# EAGLE design WiFi_Switch (EAGLE 7.7.0)
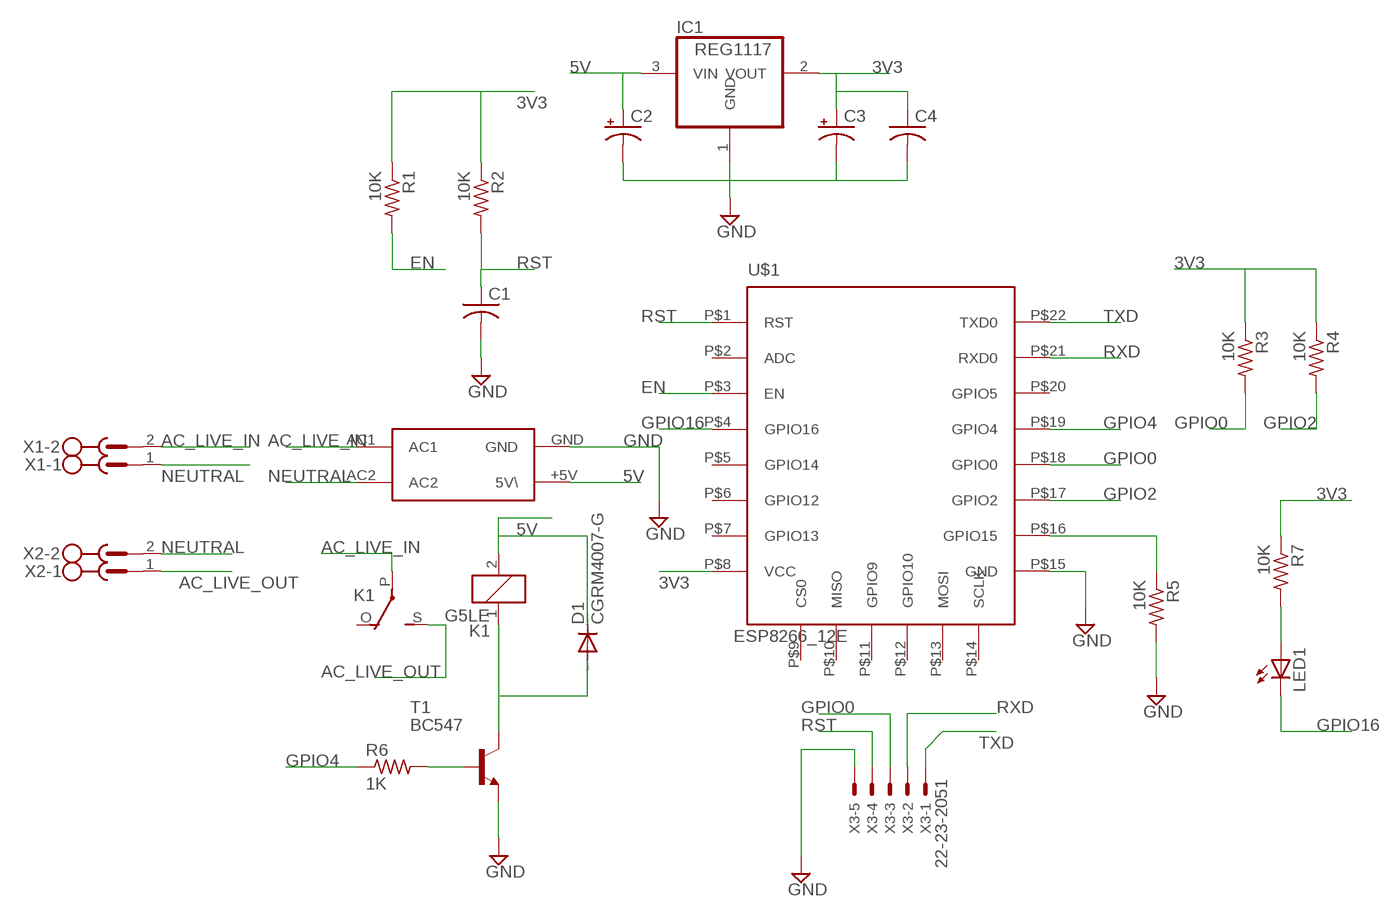
[diagram p0: schematic, sheet 1]

## Parts
C1  C-USC1206  [C1206]
C2  CPOL-USE5-6  [E5-6]
C3  CPOL-USE5-6  [E5-6]
C4  C-USC1206  [C1206]
D1  CGRM4007-G  [SOD-123_MINI-SMA]
IC1  REG1117  [SOT223]
K1  G5LE  [G5LE]
LED1  LED3MM  [LED3MM]
R1  10K  R-US_R1206  [R1206]
R2  10K  R-US_R1206  [R1206]
R3  10K  R-US_R1206  [R1206]
R4  10K  R-US_R1206  [R1206]
R5  10K  R-US_R1206  [R1206]
R6  1K  R-US_R1206  [R1206]
R7  10K  R-US_R1206  [R1206]
T1  BC547  [TO92]
U$1  ESP8266_12E  [SMT_ESP8266]
U$2  HILINK_SMPS_5V5W  [PCB_MOUNT]
X1  MSTBV2  [MSTBV2]
X2  MSTBV2  [MSTBV2]
X3  22-23-2051  [22-23-2051]

## Nets
3V3: C3.+ C4.1 IC1.2(VOUT) R1.1 R2.1 R3.1 R4.1 R7.1 U$1.P$8(VCC)
5V: C2.+ D1.C IC1.3(VIN) K1.2 U$2.+5V(5V\)
AC_LIVE_IN: K1.P(2:P) U$2.AC1 X1.2
AC_LIVE_OUT: K1.S(2:S) X2.1
EN: R1.2 U$1.P$3(EN)
GND: C1.2 C2.- C3.- C4.2 IC1.1(GND) R5.2 T1.1(E) U$1.P$15(GND) U$2.GND X3.5
GPIO0: R3.2 U$1.P$18(GPIO0) X3.3
GPIO2: R4.2 U$1.P$17(GPIO2)
GPIO4: R6.1 U$1.P$19(GPIO4)
GPIO16: LED1.K(C) U$1.P$4(GPIO16)
N$1: R5.1 U$1.P$16(GPIO15)
N$2: R6.2 T1.2(B)
N$3: D1.A K1.1 T1.3(C)
N$37: LED1.A R7.2
NEUTRAL: U$2.AC2 X1.1 X2.2
RST: C1.1 R2.2 U$1.P$1(RST) X3.4
RXD: U$1.P$21(RXD0) X3.2
TXD: U$1.P$22(TXD0) X3.1
Unconnected: K1.O(2:O) U$1.P$2(ADC) U$1.P$5(GPIO14) U$1.P$6(GPIO12) U$1.P$7(GPIO13) U$1.P$9(CS0) U$1.P$10(MISO) U$1.P$11(GPIO9) U$1.P$12(GPIO10) U$1.P$13(MOSI) U$1.P$14(SCLK) U$1.P$20(GPIO5)

## Library data of the parts
C1 C4 = rcl:C-US: CAPACITOR, American symbol
C2 C3 = rcl:CPOL-US: POLARIZED CAPACITOR, American symbol
D1 = diode:CGRM400*-G: Molded plasitc,JEDEC SOD-123/Mini SMA Source: Comchip CGRM4001-G.pdf
IC1 = burr-brown:REG1117: 800mA and 1A Low Dropout (LDO) Positive Regulator 1.8V, 2.5V, 2.85V, 3.3V, 5V, and Adj; MPN: REG1117; OC_FARNELL: 1097566; OC_NEWARK: 14P6981
K1 = relay:G5LE: RELAY 1 x switch, 10 A/120 V AC, 8 A/30 V DC, Omron; OC_FARNELL: unknown; OC_NEWARK: unknown
LED1 = led:LED: LED OSRAM: - CHIPLED LG R971, LG N971, LY N971, LG Q971, LY Q971, LO R971, LY R971 LH N974, LH R974 LS Q976, LO Q976, LY Q976 LO Q996 - Hyper CHIPLED LW Q18S LB Q993, LB Q99A, LB R99A - SideLED LS A670, LO A670, LY A670, LG A670, LP A670 LB A673, LV A673, LT A673, LW A673 LH A674 LY A675 LS A676, LA A676, LO A676, LY A676, LW A676 LS A679, LY A679, LG A679 - Hyper Micro SIDELED® LS Y876, LA Y876, LO Y876, LY Y876 LT Y87S - SmartLED LW L88C, LW L88S LB L89C, LB L89S, LG L890 LS L89K, LO L89K, LY L89K LS L896, LA L896, LO L896, LY L896 - TOPLED LS T670, LO T670, LY T670, LG T670, LP T670 LSG T670, LSP T670, LSY T670, LOP T670, LYG T670 LG T671, LOG T671, LSG T671 LB T673, LV T673, LT T673, LW T673 LH T674 LS T676, LA T676, LO T676, LY T676, LB T676, LH T676, LSB T676, LW T676 LB T67C, LV T67C, LT T67C, LS T67K, LO T67K, LY T67K, LW E67C LS E67B, LA E67B, LO E67B, LY E67B, LB E67C, LV E67C, LT E67C LW T67C LS T679, LY T679, LG T679 LS T770, LO T770, LY T770, LG T770, LP T770 LB T773, LV T773, LT T773, LW T773 LH T774 LS E675, LA E675, LY E675, LS T675 LS T776, LA T776, LO T776, LY T776, LB T776 LHGB T686 LT T68C, LB T68C - Hyper Mini TOPLED® LB M676 - Mini TOPLED Santana® LG M470 LS M47K, LO M47K, LY M47K Source: http://www.osram.convergy.de LUXEON: - LUMILED® LXK2-PW12-R00, LXK2-PW12-S00, LXK2-PW14-U00, LXK2-PW14-V00 LXK2-PM12-R00, LXK2-PM12-S00, LXK2-PM14-U00 LXK2-PE12-Q00, LXK2-PE12-R00, LXK2-PE12-S00, LXK2-PE14-T00, LXK2-PE14-U00 LXK2-PB12-K00, LXK2-PB12-L00, LXK2-PB12-M00, LXK2-PB14-N00, LXK2-PB14-P00, LXK2-PB14-Q00 LXK2-PR12-L00, LXK2-PR12-M00, LXK2-PR14-Q00, LXK2-PR14-R00 LXK2-PD12-Q00, LXK2-PD12-R00, LXK2-PD12-S00 LXK2-PH12-R00, LXK2-PH12-S00 LXK2-PL12-P00, LXK2-PL12-Q00, LXK2-PL12-R00 Source: www.luxeon.com KINGBRIGHT: KA-3528ASYC Source: www.kingbright.com
R1-R7 = resistor:R-US_: RESISTOR, American symbol
T1 = transistor:BC547: NPN TRANSISTOR
U$1 = ESP_WiFi_Module:ESP8266_12E
U$2 = hilink_smps_5w5v:HILINK_SMPS_5V5W
X1 X2 = con-phoenix-500:MSTBV2: PHOENIX; OC_FARNELL: unknown; OC_NEWARK: unknown
X3 = con-molex:22-23-2051: .100" (2.54mm) Center Header - 5 Pin; MF: MOLEX; MPN: 22-23-2051; OC_FARNELL: 1462952; OC_NEWARK: 38C9178

## Board
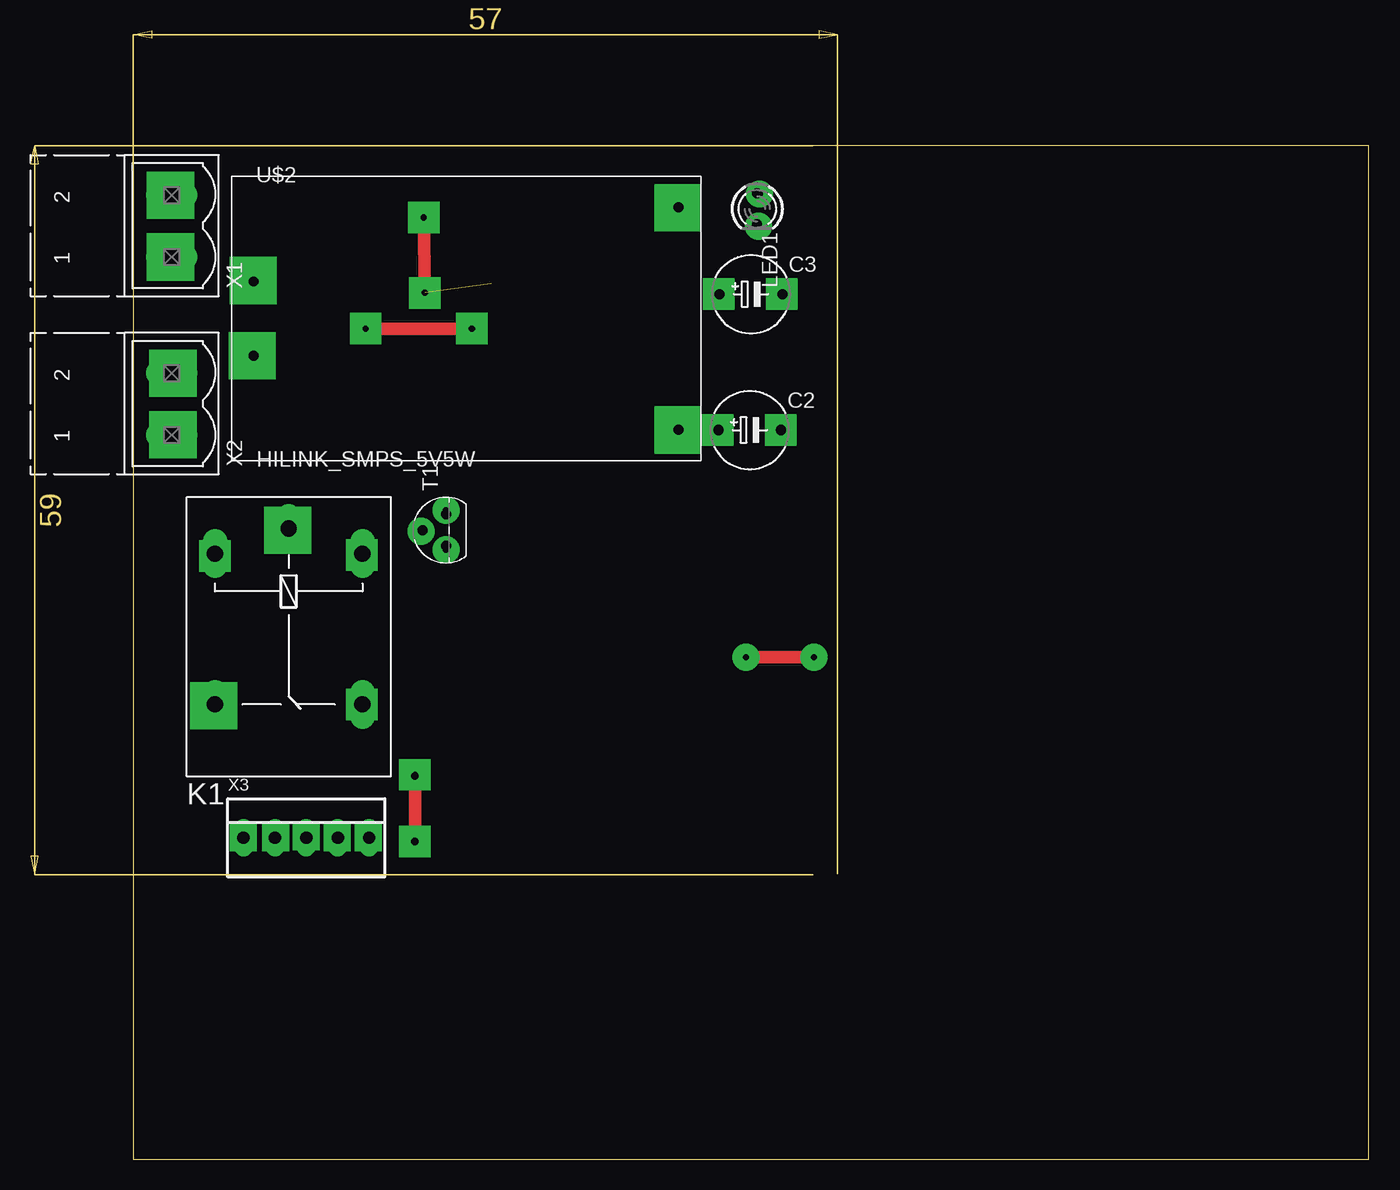
[diagram p1: board, top side]
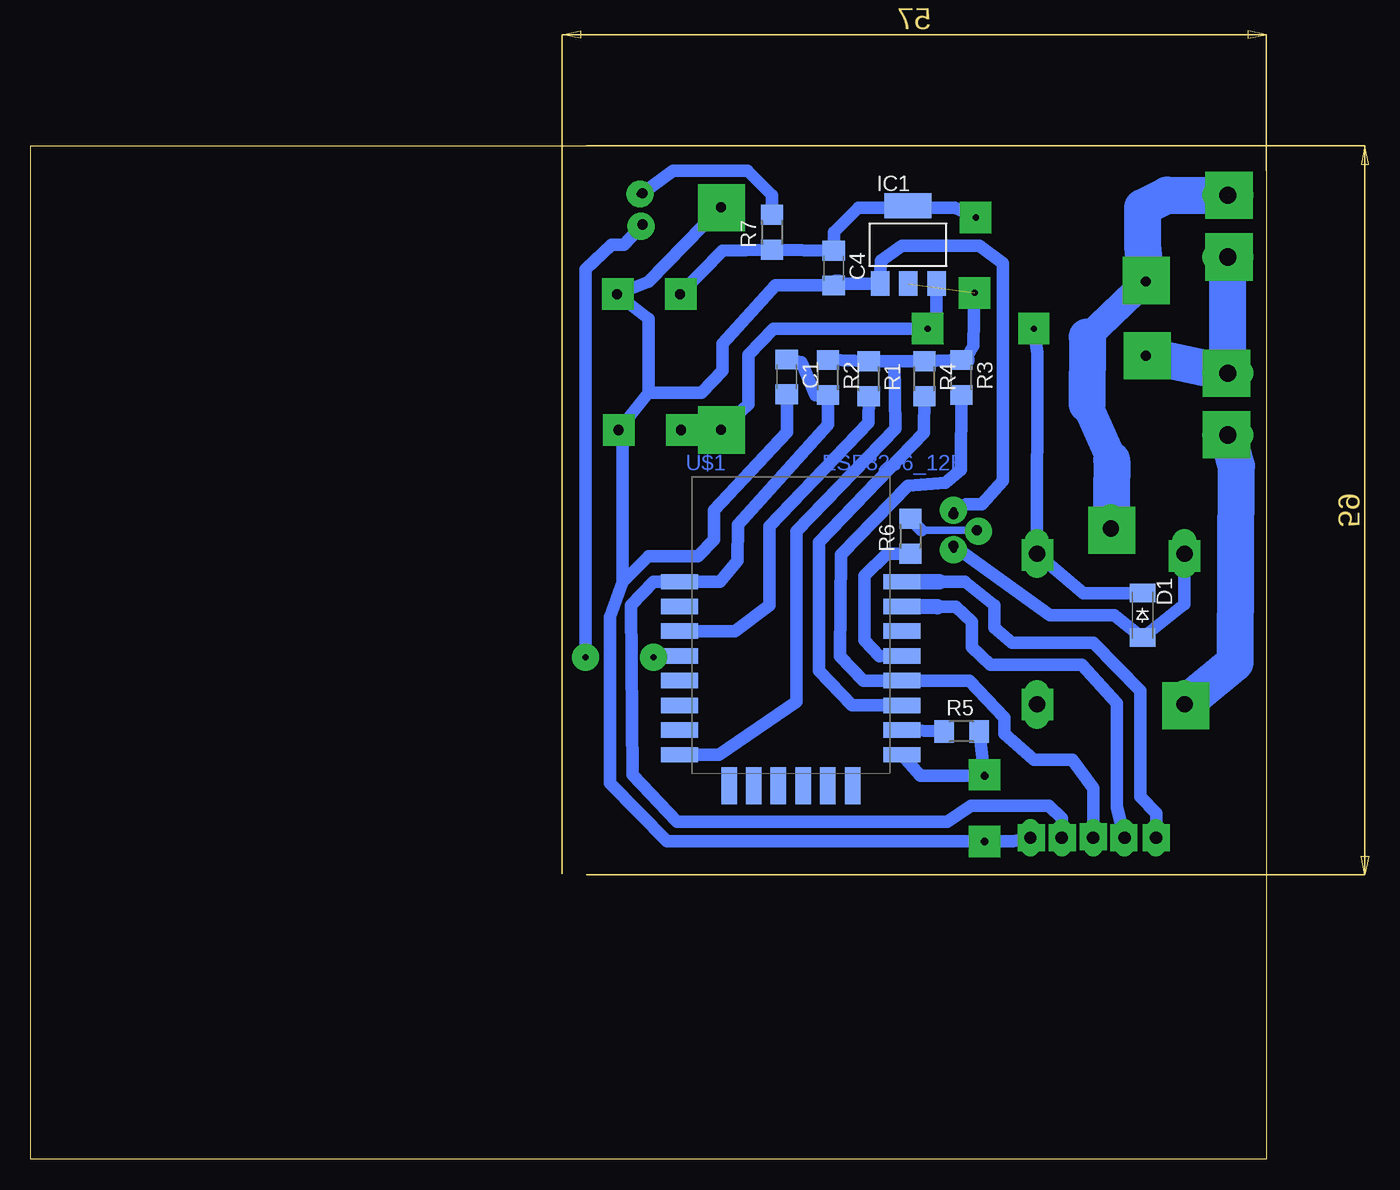
[diagram p2: board, bottom side, seen from below]

Size 100 x 82 mm. Coordinates in mm from the lower left corner, seen from the top.
Outline: 0,0 100,0 100,82 0,82 0,0
Copper layers (1*16): Top 0.035mm / dielectric 1.5mm / Bottom 0.035mm
Design rules "default": minimum track width 10mil, minimum drill 24mil, track to track 8mil, track to pad 8mil, pad to pad 8mil, via to via 8mil, smd to smd 8mil, copper to edge 40mil, drill to drill 8mil, minimum pad ring 10mil, minimum via ring 8mil, stop-mask expansion 4mil, vias tented up to drill 0mil, thermal gap 10mil

### Footprints (pad centres in the part's own frame; a part is rotated, then mirrored left to right if it is on the bottom)
C1206 = smd 1.6 x 1.8: 1 -1.4,0; 2 1.4,0
E5-6 = drill 0.813 pad 1.905: + -2.54,0 | drill 0.813 pad 1.905 octagon: - 2.54,0
SOD-123_MINI-SMA = smd 1.5 x 2.1: A 1.8,0; C -1.8,0
SOT223 = smd 1.499 x 2.007: 1 -2.261,-3.15; 2 0.025,-3.15; 3 2.311,-3.15 | smd 3.81 x 2.007: 4 0,3.15
G5LE = drill 1.321 long: 1 -7.493,-5.969; 2 -7.493,5.969; O 4.699,5.969; P -9.525,0; S 4.699,-5.969
LED3MM = drill 0.813 octagon: A -1.27,0; K 1.27,0
R1206 = smd 1.6 x 1.803: 1 -1.422,0; 2 1.422,0
TO92 = drill 0.813 octagon: 1 1.27,0; 2 0,1.905; 3 -1.27,0
SMT_ESP8266 = smd 3 x 1.25: P$1 -9,3.5; P$2 -9,1.5; P$3 -9,-0.5; P$4 -9,-2.5; P$5 -9,-4.5; P$6 -9,-6.5; P$7 -9,-8.5; P$8 -9,-10.5; P$15 9,-10.5; P$16 9,-8.5; P$17 9,-6.5; P$18 9,-4.5; P$19 9,-2.5; P$20 9,-0.5; P$21 9,1.5; P$22 9,3.5 | smd 1.25 x 3: P$9 -5,-13; P$10 -3,-13; P$11 -1,-13; P$12 1,-13; P$13 3,-13; P$14 5,-13
PCB_MOUNT = drill 0.8 octagon: +5V 17.2,-9; AC1 -17.2,3; AC2 -17.2,-3; GND 17.2,9
MSTBV2 = drill 1.397 long: 1 -2.5,0; 2 2.5,0
22-23-2051 = drill 1 long: 1 -5.08,0; 2 -2.54,0; 3 0,0; 4 2.54,0; 5 5.08,0

### Placement (x,y rotation side)
C1  38.8,63.3 270 bottom
C2  49.9,59 0 top
C3  50,70 0 top
C4  35,72.1 270 bottom
D1  10,44 270 bottom
IC1  29,74 0 bottom
K1  12.57,41.5 270 top
LED1  50.5,76.9 270 top
R1  32.17,63.15 270 bottom
R2  35.47,63.25 270 bottom
R3  24.67,63.25 270 bottom
R4  27.67,63.15 270 bottom
R5  24.65,34.61 0 bottom
R6  28.8,50.4 90 bottom
R7  40,75 90 bottom
T1  25.3,50.9 90 top
U$1  38.48,43.22 0 bottom
U$2  26.94,68.02 0 top
X1  3.1,75.5 90 top
X2  3.1,61.1 90 top
X3  14,26 0 top

### Tracks (layer width: path | path; a pad name or v marks a point on that pad's centre or on a via)
3V3  (via drill 0.5 pad 2.54)  (1 unrouted)
  Top 1: v23.6,70.1 v23.5,76.2
  Bottom 1: 30.09,64.57 R4.1 R3.1 | 30.09,64.57 R1.1 R2.1 | 24.33,64.67 23.7,65.8 v23.6,70.1 | C3.+ 44,73.5 R7.1 C4.1 35,75 33,77 25.2,77 v23.5,76.2 | 30.09,64.57 30,59.1 38,50.8 38,37 44.3,32.7 U$1.P$8
  Bottom 1.5: IC1.2 29,70.88 | R3.1 24.33,64.67
5V  (via drill 0.5 pad 2.54)
  Top 1: v18.8,67.2 v27.4,67.2
  Bottom 1: C2.+ U$2.+5V 41.9,61.1 41.9,65.1 39.9,67.2 v27.4,67.2 26.7,68.3 IC1.3 | D1.C 14.8,45.8 K1.2 18.5,65.2 v18.8,67.2
AC_LIVE_IN
  Bottom 2.184: U$2.AC1 14.48,66.52
  Bottom 2.5: 14.5,61.1 12.5,56.55
  Bottom 3: U$2.AC1 10,73.86 10,77 8,78 X1.2 | 14.48,66.52 14.5,61.1 | 12.5,56.55 K1.P
AC_LIVE_OUT
  Bottom 3: K1.S 2.5,40.2 2.4,56.1 X2.1
EN
  Bottom 1: U$1.P$3 43,42.7 40.2,44.8 40.2,51.2 32.2,59.6 R1.2
GND  (via drill 0.5 pad 2.54, 0.6)
  Top 1: v22.8,25.7 v22.8,31
  Bottom 1: 34.64,70.85 IC1.1 31.2,72.7 29.5,73.9 23.2,73.9 21.3,72.5 21.3,54.9 23,53 24.3,53 T1.1 | X3.5 20.5,25.7 v22.8,25.7 48.5,25.7 53.1,30.4 53.1,43.9 52.09,46.7 | C1.2 38.8,58.8 44.7,52.5 44.7,50.1 46,48.8 50,48.8 52.09,46.7 | 52.09,46.7 52.1,58.2 C2.- 50,62 | 53.1,70.3 C3.- | C3.- 50,68 50,62 | U$2.GND 50,71 C3.- | C4.2 39.7,70.7 44,66 44,63.8 45.7,62 50,62 | R5.2 v22.8,31 28,31 U$1.P$15
  Bottom 1.5: 34.64,70.85 arc-45 C4.2
GPIO0  (via drill 0.5 pad 2.18)
  Bottom 1: X3.3 v14,26.1 14,30 15.7,32.3 18.8,32.3 21.2,34.4 21.2,35.7 24.02,38.72 U$1.P$18 32.6,38.7 34.5,40.7 34.4,48.9 29,54.5 25.97,54.73 24.7,55.8 R3.2
GPIO2
  Bottom 1: U$1.P$17 33.52,36.72 36.2,39.5 36.2,49.9 27.7,58.76 R4.2
GPIO4
  Bottom 1: U$1.P$19 31.3,40.7 32.5,42 32.5,47.2 30.7,49 R6.1
GPIO16  (via drill 0.5 pad 2.18)
  Top 1: v55.1,40.6 v49.6,40.6
  Bottom 1: LED1.K 52,74 53,74 55.1,72 v55.1,40.6 | v49.6,40.6 U$1.P$4
N$1
  Bottom 1: R5.1 U$1.P$16
N$2
  Bottom 0.61: T1.2 27.9,50.9
  Bottom 1: 27.9,50.9 R6.2
N$3
  Bottom 1: K1.1 6.6,44.9 D1.A 12.3,44 17.5,44 T1.3
N$6  (via drill 0.5 pad 2.18)
  other vias: 19,26
N$10  (via drill 0.5 pad 2.18)
  other vias: 16.5,26
N$15  (via drill 0.5 pad 2.18)
  other vias: 11.5,26
N$18  (via drill 0.5 pad 2.18)
  other vias: 8.9,26
N$19  (via drill 0.5 pad 3.81)
  other vias: 44.1,59
N$20  (via drill 0.5 pad 2.54)
  other vias: 22.8,31.1
N$21  (via drill 0.5 pad 3.81)
  other vias: 44.1,77
N$22  (via drill 0.5 pad 3.81)
  other vias: 9.7,71.1
N$23  (via drill 0.5 pad 3.81)
  other vias: 9.6,65
N$24  (via drill 0.5 pad 2.54)
  other vias: 18.8,67.2
N$25  (via drill 0.5 pad 2.54)
  other vias: 47.4,70
N$26  (via drill 0.5 pad 2.54)
  other vias: 52.5,70
N$27  (via drill 0.5 pad 2.54)
  other vias: 52.4,59
N$28  (via drill 0.5 pad 2.54)
  other vias: 47.3,59
N$29  (via drill 0.5 pad 2.54)
  other vias: 6.6,48.8
N$30  (via drill 0.5 pad 2.54)
  other vias: 18.5,48.9
N$31  (via drill 0.5 pad 2.54)
  other vias: 18.5,36.8
N$32  (via drill 0.5 pad 3.81)
  other vias: 12.5,50.9
N$33  (via drill 0.5 pad 3.81)
  other vias: 6.5,36.7
N$34  (via drill 0.5 pad 2.18)
  other vias: 25.3,49.3
N$35  (via drill 0.5 pad 2.18)
  other vias: 25.3,52.5
N$36  (via drill 0.5 pad 2.18)
  other vias: 23.3,50.8
N$37
  Bottom 1: R7.2 40,78 42,80 48,80 LED1.A
N$38  (via drill 0.5 pad 2.18)
  other vias: 50.6,75.5
N$39  (via drill 0.5 pad 2.18)
  other vias: 50.7,78.1
N$41  (1 unrouted)
N$43  (via drill 0.5 pad 3.81)
  other vias: 3,78
N$44  (via drill 0.5 pad 3.81)
  other vias: 3,73
N$45  (via drill 0.5 pad 3.81)
  other vias: 3.2,63.6
N$46  (via drill 0.5 pad 3.81)
  other vias: 3.2,58.6
NEUTRAL
  Bottom 3: U$2.AC2 X2.2 X1.1
RST
  Bottom 1: R2.2 35.47,59.43 42.76,51.34 42.8,48.4 44.2,46.7 U$1.P$1 49.6,46.7 51.4,44.8 51.3,31.1 47.7,27.3 25.8,27.3 23.9,28.6 17.6,28.6 16.54,27.56 X3.4 | 35.5,61.8 36.5,61.8 37.6,64.5 C1.1
  Bottom 1.5: 35.5,61.8 R2.2
RXD
  Bottom 1: X3.2 12.1,28.5 12.1,36.9 14.9,40 22.3,40 23.8,41.4 23.8,43.5 25.1,44.7 26.6,44.7
  Bottom 1.27: U$1.P$21 26.6,44.7
TXD
  Bottom 1: X3.1 8.9,28 10.2,29.3 10.2,37.9 14,41.8 20.6,41.8 22,43 22,44.8 24.4,46.7 26.46,46.7
  Bottom 1.27: 26.46,46.7 U$1.P$22